# EasyEDA Pro project ProPrj_MOSSE_2026-03-25.epro, board PCB3
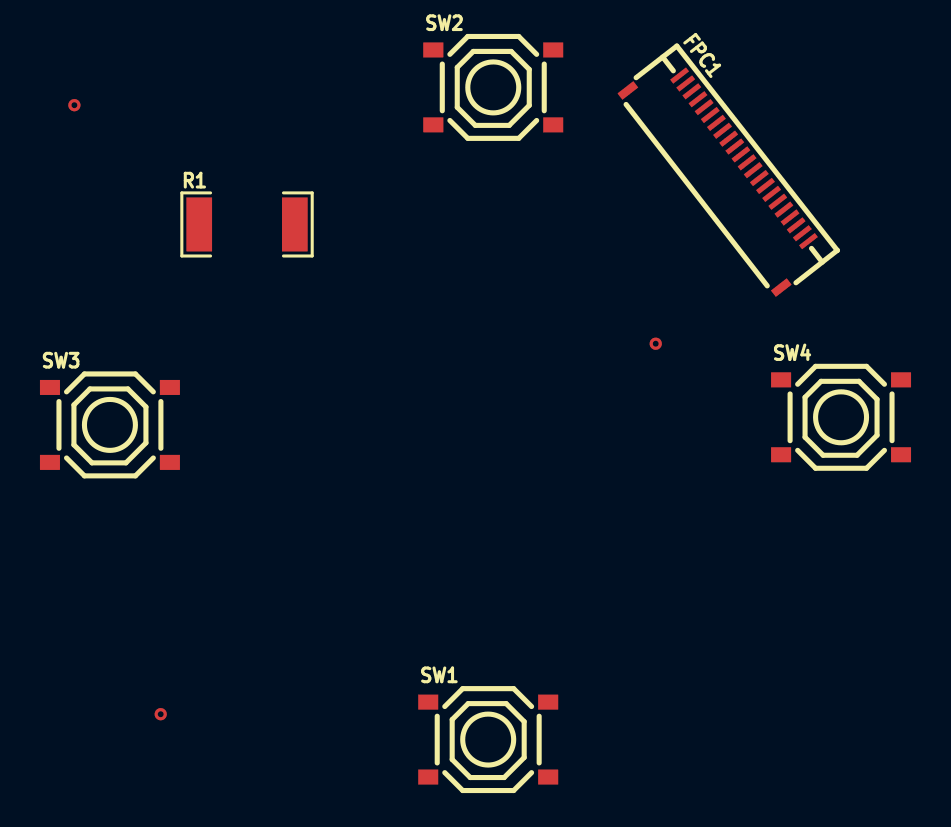
[diagram p7: board, top side]
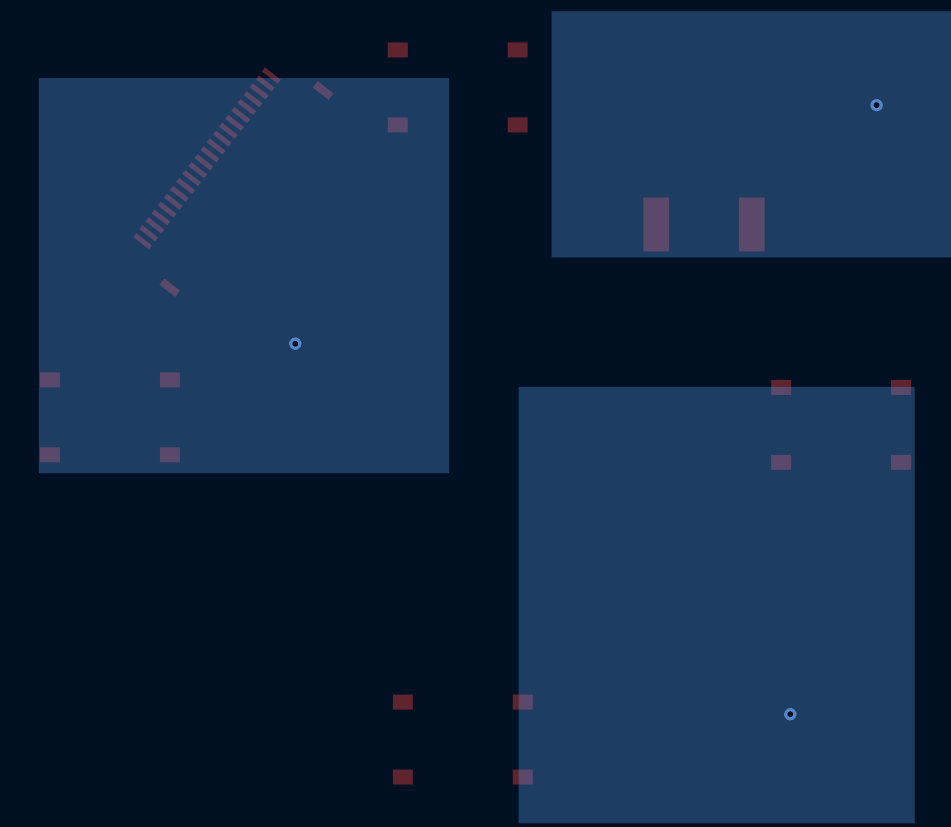
[diagram p8: board, bottom side, seen from below]

No outline. copper layers: Top Layer, Bottom Layer. Coordinates in mm from the lowest, leftmost part position.
Stack: Top Layer 0.035mm / Dielectric1 1.51mm FR4 er 4.5 / Bottom Layer 0.035mm

## Design rules (mm)
template: JLCPCB Capability(Two Layers Board)
spacing copperThickness1oz (default): track to track 0.102, other pairs 0.152 to 0.3
spacing copperThickness2oz: track to track 0.203, other pairs 0.152 to 0.3
track width copperThickness1oz (default): min 0.127, default 0.254, max 2.54
track width copperThickness2oz: min 0.203, default 0.254, max 2.54
differential pair differentialPair (default): width min 0.127, default 0.254, max 2.54; gap min 0.152, default 0.152
via viaSize (default): diameter min 0.5, default 0.61, max 10; hole min 0.3, default 0.305, max 6.3

## Placement (name value [footprint] x y rotation side)
FPC1  FH34SRJ-22S-0.5SH(50)  [FFC-SMD_22P-P0.50_HRS_FH34SRJ-22S-0.5SH]  30.73 28.32 307.9 top
R1  https://www.lcsc.com/product-detail/C5632412.html  [R2010]  6.86 25.78 0 top
SW1  TS-1187A-B-A-B  [SW-SMD_4P-L5.1-W5.1-P3.70-LS6.5-TL_H1.5]  18.92 0 0 top
SW2  TS-1187A-B-A-B  [SW-SMD_4P-L5.1-W5.1-P3.70-LS6.5-TL_H1.5]  19.18 32.64 0 top
SW3  TS-1187A-B-A-B  [SW-SMD_4P-L5.1-W5.1-P3.70-LS6.5-TL_H1.5]  0 15.75 0 top
SW4  TS-1187A-B-A-B  [SW-SMD_4P-L5.1-W5.1-P3.70-LS6.5-TL_H1.5]  36.58 16.13 0 top

## Footprints (pads in the part's own frame, mm; a bottom-side part is the same pattern mirrored in y, then rotated)
FFC-SMD_22P-P0.50_HRS_FH34SRJ-22S-0.5SH
  rect 0.25x1 smd: 1(5.25,1.25) 2(4.75,1.25) 3(4.25,1.25) 4(3.75,1.25) 5(3.25,1.25) 6(2.75,1.25) 7(2.25,1.25) 8(1.75,1.25) 9(1.25,1.25) 10(0.75,1.25) 11(0.25,1.25) 12(-0.25,1.25) 13(-0.75,1.25) 14(-1.25,1.25) 15(-1.75,1.25) 16(-2.25,1.25) 17(-2.75,1.25) 18(-3.25,1.25) 19(-3.75,1.25) 20(-4.25,1.25) 21(-4.75,1.25) 22(-5.25,1.25)
  rect 0.4x1 smd: 23(-6.25,-1.25) 24(6.25,-1.25)
R2010
  rect 1.282x2.7 smd: 1(-2.391,0) 2(2.391,0)
SW-SMD_4P-L5.1-W5.1-P3.70-LS6.5-TL_H1.5
  rect 1x0.75 smd: 1(-3,1.875) 2(3,1.875) 3(-3,-1.875) 4(3,-1.875)

## Nets
GND: FPC1.1 FPC1.3 FPC1.5 FPC1.7 FPC1.12 FPC1.13 FPC1.14 FPC1.23 FPC1.24
BTN_E: FPC1.10
BTN_N: FPC1.8
BTN_S: FPC1.9
BTN_W: FPC1.11
HAP_N: FPC1.16
HAP_P: FPC1.15
SNS0: FPC1.2
SNS1: FPC1.4
SNS2: FPC1.6
$1N315: FPC1.17 FPC1.18 FPC1.19 FPC1.20 FPC1.21 FPC1.22

Pads without a net: R1 1 2; SW1 1 2 3 4; SW2 1 2 3 4; SW3 1 2 3 4; SW4 1 2 3 4

## Via types
v1: diameter 0.61, hole 0.305, Top Layer to Bottom Layer, 3 vias

## Routing (per net, layer and track width the routed paths; a pad name or vN(x,y) marks a point on that pad's centre or on a via; arc(x,y) is an arc through that point)
(no net):
  vias: v1(-1.78,31.75) v1(2.54,1.27) v1(27.31,19.81)

## Copper pours and planes (outline as drawn; the poured copper is in the pictures)
(no net) on Bottom Layer: -6.35,36.45 14.48,36.45 14.48,24.13 -6.35,24.13
(no net) on Bottom Layer: 19.61,33.11 40.13,33.11 40.13,13.34 19.61,13.34
(no net) on Bottom Layer: -3.68,17.65 16.13,17.65 16.13,-4.19 -3.68,-4.19
